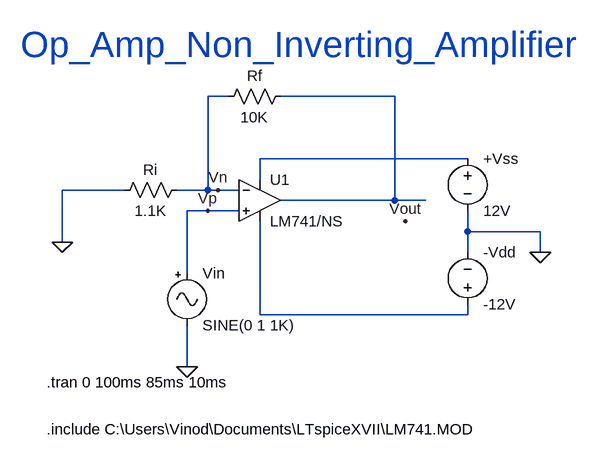
[diagram p0: schematic OP-Amp_Inverting Amplifier.asc]
OP-Amp_Inverting Amplifier.asc, the LTspice schematic file:
Version 4
SHEET 1 880 680
WIRE 176 0 144 0
WIRE 432 0 256 0
WIRE 544 96 224 96
WIRE 224 128 224 96
WIRE 16 144 -80 144
WIRE 144 144 144 0
WIRE 144 144 96 144
WIRE 160 144 144 144
WIRE 192 144 160 144
WIRE 432 160 432 0
WIRE 432 160 256 160
WIRE 480 160 432 160
WIRE 144 176 112 176
WIRE 192 176 144 176
WIRE 544 208 544 176
WIRE 656 208 544 208
WIRE -80 224 -80 144
WIRE 544 240 544 208
WIRE 656 240 656 208
WIRE 112 272 112 176
WIRE 224 336 224 192
WIRE 544 336 544 320
WIRE 544 336 224 336
WIRE 112 416 112 352
FLAG -80 224 0
FLAG 112 416 0
FLAG 656 240 0
FLAG 160 144 Vn
FLAG 144 176 Vp
FLAG 448 192 Vout
DATAFLAG 416 160 ""
DATAFLAG 416 160 ""
SYMBOL res 272 -16 R90
WINDOW 0 0 56 VBottom 2
WINDOW 3 32 56 VTop 2
SYMATTR InstName Rf
SYMATTR Value 10K
SYMBOL res 112 128 R90
WINDOW 0 0 56 VBottom 2
WINDOW 3 32 56 VTop 2
SYMATTR InstName Ri
SYMATTR Value 1.1K
SYMBOL Misc\\signal 112 256 R0
SYMATTR InstName Vin
SYMBOL voltage 544 80 R0
SYMATTR InstName +Vss
SYMATTR Value 12V
SYMBOL voltage 544 336 M180
WINDOW 0 24 96 Left 2
WINDOW 3 24 16 Left 2
SYMATTR InstName -Vdd
SYMATTR Value -12V
SYMBOL OpAmps\\opamp2 224 96 R0
SYMATTR InstName U1
SYMATTR Value LM741/NS
TEXT -104 440 Left 2 !.tran 0 100ms 85ms 10ms
TEXT -144 -80 Left 5 ;Op_Amp_Non_Inverting_Amplifier
TEXT -104 512 Left 2 !.include C:\\Users\\Vinod\\Documents\\LTspiceXVII\\LM741.MOD

The netlist it stands for:
* OP-Amp_Inverting Amplifier.asc
Rf N001 Vn 10K
Ri Vn 0 1.1K
Vin Vp 0 SINE(0 1 1K)
V§+Vss N002 0 12V
V§-Vdd N003 0 -12V
XU1 Vp Vn N002 N003 N001 LM741/NS  ; pins In+ In- V+ V- OUT
.tran 0 100ms 85ms 10ms
* Op_Amp_Non_Inverting_Amplifier
.include C:\Users\Vinod\Documents\LTspiceXVII\LM741.MOD
.backanno
.end